# Altium schematic sheet CR2032_Battery_Connector.SchDoc: CR2032 Battery Connector
size A4
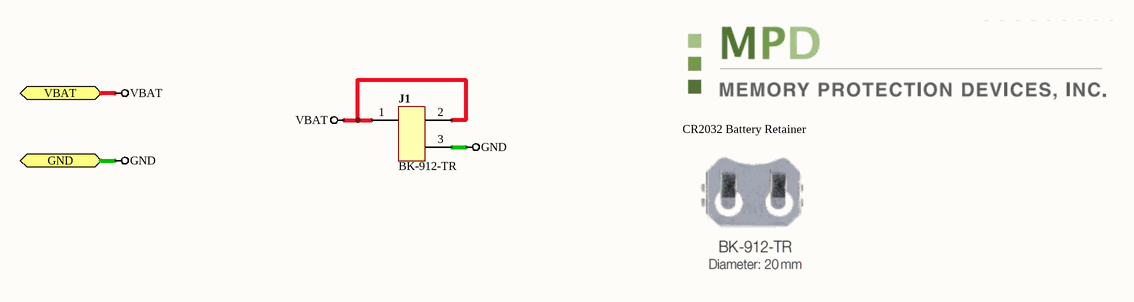
[diagram p0: CR2032_Battery_Connector.SchDoc]

## Parts
J1  BK-912-TR  [MPD-CN-DIN-3_V]

## Ports
GND, VBAT

## Nets
GND: J1.3(NEGATIVE) ; port GND
VBAT: J1.1(POSITIVE) J1.2(POSITIVE) ; port VBAT

## Notes on the sheet
- CR2032 Battery Retainer
- Sheet Title
- Project Title
- Size:
- Date:
- A4
- Item:
- Time:
- Revision:
- Sheet
- of
- File:

## Library data of the parts
J1 = CMP-0452-00001-2: Coin Cell Holder, 21.08 x 15.24 mm SMD; Manufacturer: Memory Protection Devices; Battery Series: 2032; Battery Type, Function: Coin Cell, Retainer; Number of Cells: 1; ComponentLink2URL: http://www.memoryprotectiondevices.com/datasheets/BK-912-datasheet.pdf; ComponentLink3URL: http://www.memoryprotectiondevices.com/datasheets/BK-912-datasheet.pdf; ComponentLink3Description: Package Specification; ComponentLink1Description: Manufacturer URL; Family: Battery Holders, Clips, Contacts; ComponentLink1URL: http://www.memoryprotectiondevices.com/; Mounting Technology: Surface Mount; ComponentLink2Description: Datasheet; PackageReference: CN-DIN-3; PackageDescription: 3-Pin, CN-DIN, Body 21.08x15.24mm; PartNumber: BK-912-TR; Category: Battery Products